# EAGLE design BD0005 (EAGLE 9.5.2)
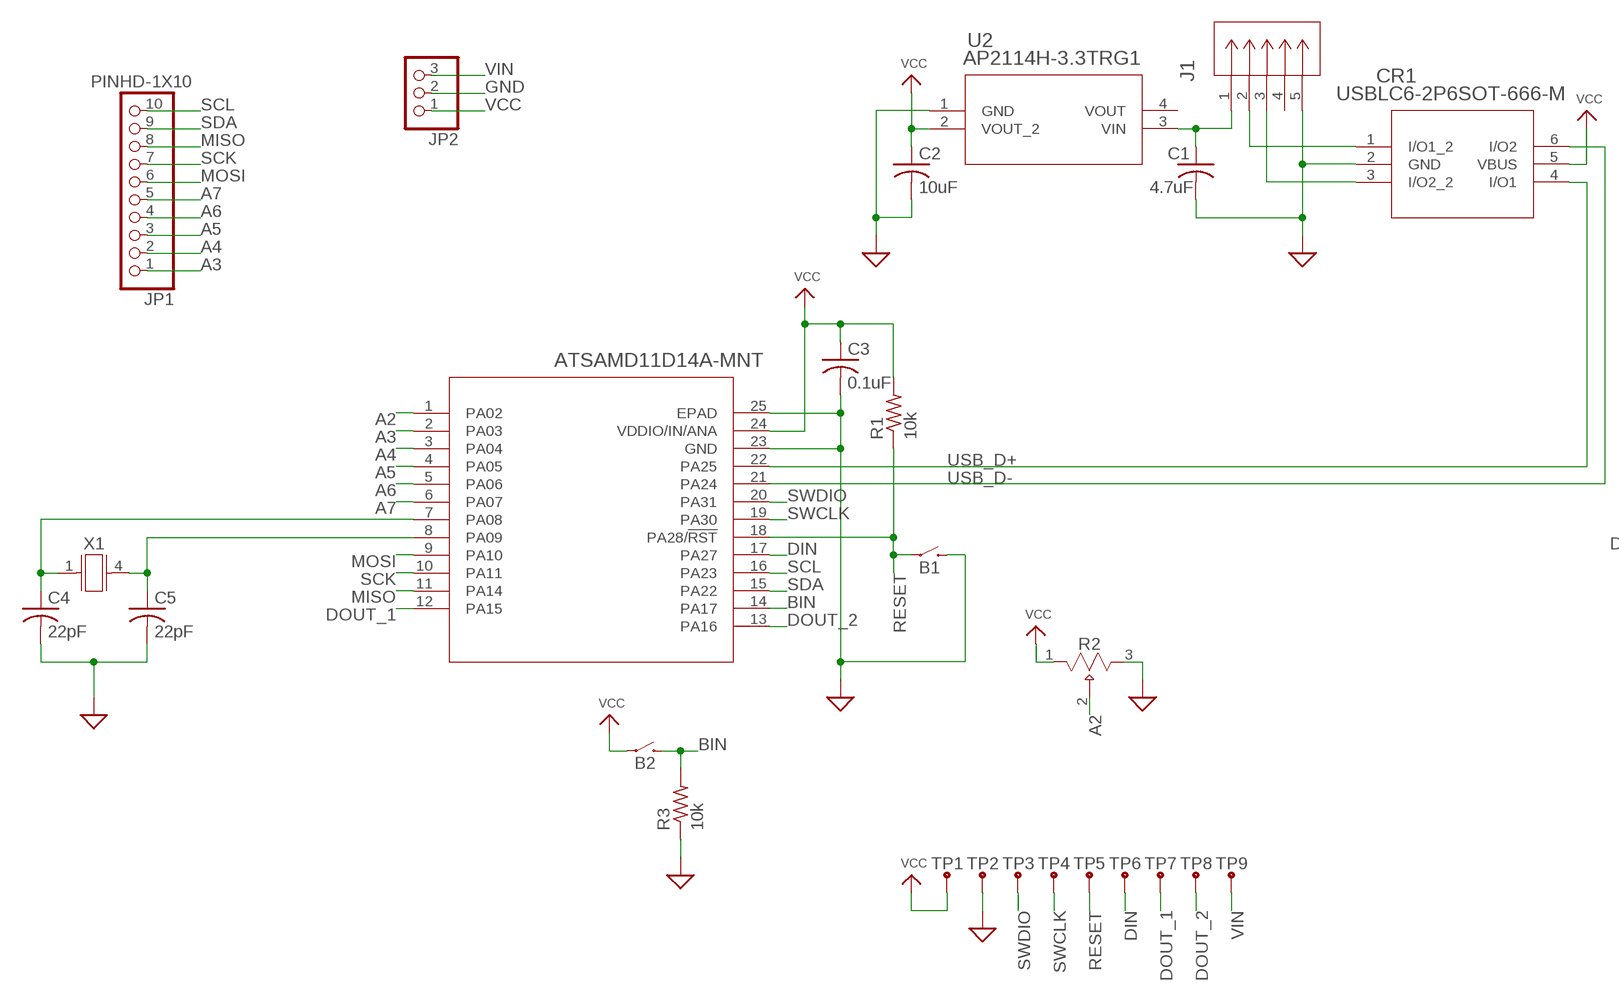
[diagram p0: schematic, sheet 1, part 1 of 2]
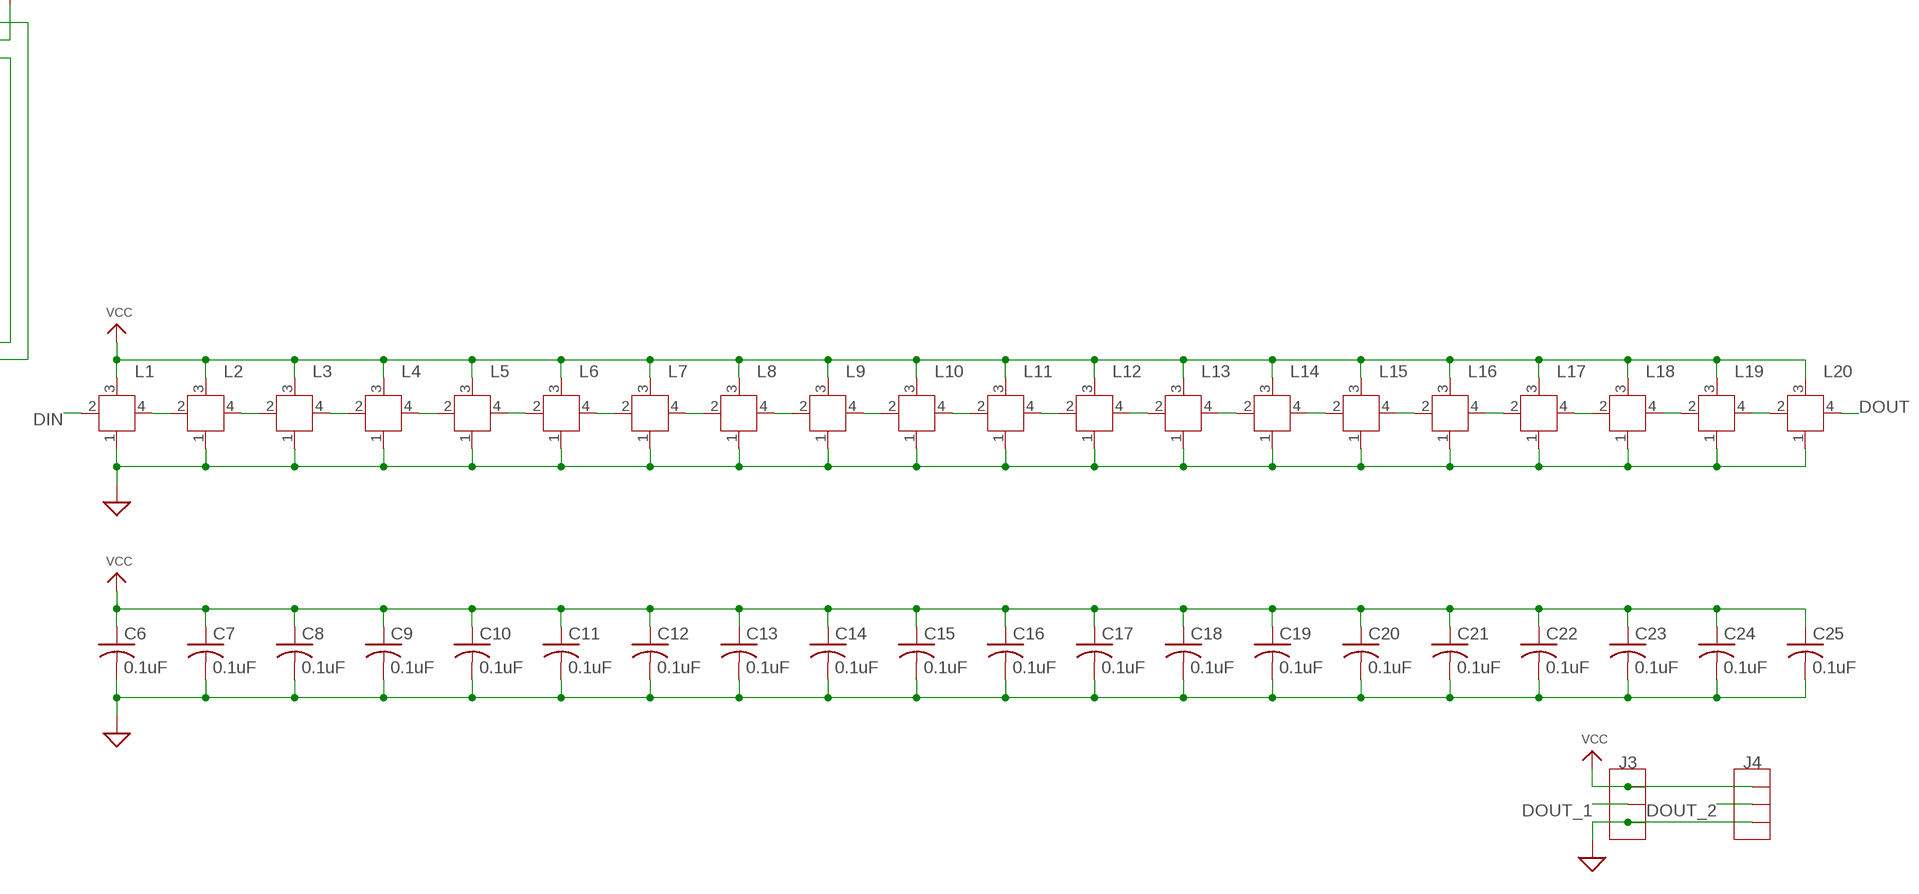
[diagram p1: schematic, sheet 1, part 2 of 2]

## Parts
B1  EVQ-P7A01P  [4-SMD_BUTTON]
B2  EVQ-P7A01P  [4-SMD_BUTTON]
C1  4.7uF  C-USC0805  [C0805]
C2  10uF  C-USC0805  [C0805]
C3  0.1uF  C-USC0402  [C0402]
C4  22pF  C-USC0402  [C0402]
C5  22pF  C-USC0402  [C0402]
C6  0.1uF  C-USC0402  [C0402]
C7  0.1uF  C-USC0402  [C0402]
C8  0.1uF  C-USC0402  [C0402]
C9  0.1uF  C-USC0402  [C0402]
C10  0.1uF  C-USC0402  [C0402]
C11  0.1uF  C-USC0402  [C0402]
C12  0.1uF  C-USC0402  [C0402]
C13  0.1uF  C-USC0402  [C0402]
C14  0.1uF  C-USC0402  [C0402]
C15  0.1uF  C-USC0402  [C0402]
C16  0.1uF  C-USC0402  [C0402]
C17  0.1uF  C-USC0402  [C0402]
C18  0.1uF  C-USC0402  [C0402]
C19  0.1uF  C-USC0402  [C0402]
C20  0.1uF  C-USC0402  [C0402]
C21  0.1uF  C-USC0402  [C0402]
C22  0.1uF  C-USC0402  [C0402]
C23  0.1uF  C-USC0402  [C0402]
C24  0.1uF  C-USC0402  [C0402]
C25  0.1uF  C-USC0402  [C0402]
CR1  USBLC6-2P6SOT-666-M  [SOT-666-M]
J1  1050171001  [CON00679_5]
J3  HEADER_1X3FEMALE  [F3SMD]
J4  HEADER_1X3FEMALE  [F3SMD]
JP1  PINHD-1X10  [1X10-BIG]
JP2  PINHD-1X3  [1X03]
L1  WS2812B  [SK6812]
L2  WS2812B  [SK6812]
L3  WS2812B  [SK6812]
L4  WS2812B  [SK6812]
L5  WS2812B  [SK6812]
L6  WS2812B  [SK6812]
L7  WS2812B  [SK6812]
L8  WS2812B  [SK6812]
L9  WS2812B  [SK6812]
L10  WS2812B  [SK6812]
L11  WS2812B  [SK6812]
L12  WS2812B  [SK6812]
L13  WS2812B  [SK6812]
L14  WS2812B  [SK6812]
L15  WS2812B  [SK6812]
L16  WS2812B  [SK6812]
L17  WS2812B  [SK6812]
L18  WS2812B  [SK6812]
L19  WS2812B  [SK6812]
L20  WS2812B  [SK6812]
R1  10k  R-US_R0402  [R0402]
R2  3352T-1-104LF  [THUMBWHEEL]
R3  10k  R-US_R0402  [R0402]
TP1  VCC  TEST_POINT  [TEST_POINT]
TP2  GND  TEST_POINT  [TEST_POINT]
TP3  DIO  TEST_POINT  [TEST_POINT]
TP4  CLK  TEST_POINT  [TEST_POINT]
TP5  RST  TEST_POINT  [TEST_POINT]
TP6  DIN  TEST_POINT  [TEST_POINT]
TP7  DO1  TEST_POINT  [TEST_POINT]
TP8  DO2  TEST_POINT  [TEST_POINT]
TP9  VIN  TEST_POINT  [TEST_POINT]
U1  ATSAMD11D14A-MNT  [QFN24_4X4MC]
U2  AP2114H-3.3TRG1  [SOT-223]
X1  MC-146-32.7680JKA-A0:ROHS  [4-SMD_FLAT_LEADS]

## Nets
A2: R2.2 U1.1(PA02)
A3: JP1.1 U1.2(PA03)
A4: JP1.2 U1.3(PA04)
A5: JP1.3 U1.4(PA05)
A6: JP1.4 U1.5(PA06)
A7: JP1.5 U1.6(PA07)
BIN: B2.2A B2.2B R3.2 U1.14(PA17)
DIN: L1.2(DIN) TP6.P$1 U1.17(PA27)
DOUT: L20.4(DOUT)
DOUT_1: J3.2A J3.2B TP7.P$1 U1.12(PA15)
DOUT_2: J4.2A J4.2B TP8.P$1 U1.13(PA16)
GND: B1.2A B1.2B C1.2 C2.2 C3.2 C4.2 C5.2 C6.2 C7.2 C8.2 C9.2 C10.2 C11.2 C12.2 C13.2 C14.2 C15.2 C16.2 C17.2 C18.2 C19.2 C20.2 C21.2 C22.2 C23.2 C24.2 C25.2 CR1.2(GND) J1.5 J3.3A J3.3B J4.3A J4.3B JP2.2 L1.1(VSS) L2.1(VSS) L3.1(VSS) L4.1(VSS) L5.1(VSS) L6.1(VSS) L7.1(VSS) L8.1(VSS) L9.1(VSS) L10.1(VSS) L11.1(VSS) L12.1(VSS) L13.1(VSS) L14.1(VSS) L15.1(VSS) L16.1(VSS) L17.1(VSS) L18.1(VSS) L19.1(VSS) L20.1(VSS) R2.3 R3.1 TP2.P$1 U1.23(GND) U1.25(EPAD) U2.1(GND) ; supply symbol labelled SUP
MISO: JP1.8 U1.11(PA14)
MOSI: JP1.6 U1.9(PA10)
N$1: CR1.3(I/O2_2) J1.3
N$3: CR1.1(I/O1_2) J1.2
N$4: C4.1 U1.7(PA08) X1.1
N$5: C5.1 U1.8(PA09) X1.4
N$8: L19.4(DOUT) L20.2(DIN)
N$9: L18.4(DOUT) L19.2(DIN)
N$10: L17.4(DOUT) L18.2(DIN)
N$11: L16.4(DOUT) L17.2(DIN)
N$12: L15.4(DOUT) L16.2(DIN)
N$13: L14.4(DOUT) L15.2(DIN)
N$14: L13.4(DOUT) L14.2(DIN)
N$15: L12.4(DOUT) L13.2(DIN)
N$16: L11.4(DOUT) L12.2(DIN)
N$17: L10.4(DOUT) L11.2(DIN)
N$18: L9.4(DOUT) L10.2(DIN)
N$19: L8.4(DOUT) L9.2(DIN)
N$20: L7.4(DOUT) L8.2(DIN)
N$21: L1.4(DOUT) L2.2(DIN)
N$22: L2.4(DOUT) L3.2(DIN)
N$23: L3.4(DOUT) L4.2(DIN)
N$24: L4.4(DOUT) L5.2(DIN)
N$25: L5.4(DOUT) L6.2(DIN)
N$26: L6.4(DOUT) L7.2(DIN)
RESET: B1.1A B1.1B R1.1 TP5.P$1 U1.18(PA28/!RST)
SCK: JP1.7 U1.10(PA11)
SCL: JP1.10 U1.16(PA23)
SDA: JP1.9 U1.15(PA22)
SWCLK: TP4.P$1 U1.19(PA30)
SWDIO: TP3.P$1 U1.20(PA31)
USB_D+: CR1.4(I/O1) U1.22(PA25)
USB_D-: CR1.6(I/O2) U1.21(PA24)
VCC: B2.1A B2.1B C2.1 C3.1 C6.1 C7.1 C8.1 C9.1 C10.1 C11.1 C12.1 C13.1 C14.1 C15.1 C16.1 C17.1 C18.1 C19.1 C20.1 C21.1 C22.1 C23.1 C24.1 C25.1 CR1.5(VBUS) J3.1A J3.1B J4.1A J4.1B JP2.1 L1.3(VDD) L2.3(VDD) L3.3(VDD) L4.3(VDD) L5.3(VDD) L6.3(VDD) L7.3(VDD) L8.3(VDD) L9.3(VDD) L10.3(VDD) L11.3(VDD) L12.3(VDD) L13.3(VDD) L14.3(VDD) L15.3(VDD) L16.3(VDD) L17.3(VDD) L18.3(VDD) L19.3(VDD) L20.3(VDD) R1.2 R2.1 TP1.P$1 U1.24(VDDIO/IN/ANA) U2.2(VOUT_2)
VIN: C1.1 J1.1 JP2.3 TP9.P$1 U2.3(VIN)
Unconnected: J1.4 U2.4(VOUT)

## Library data of the parts
B1 B2 = Clock:EVQ-P7A01P
C1-C25 = adafruit:C-US: CAPACITOR, American symbol
CR1 = Clock:USBLC6-2P6; BUILT_BY: EMA_UL_Team; MANUFACTURER_PART_NUMBER: USBLC6-2P6; VENDOR: STMicroelectronics
J1 = Clock:1050171001; BUILT_BY: EMA_Don; COPYRIGHT: Copyright (C) 2016 Accelerated Designs. All rights reserved; MANUFACTURER_PART_NUMBER: 1050171001; VENDOR: Molex Connector Corporation
J3 J4 = Clock:HEADER_1X3
JP1 = adafruit:PINHD-1X10: Pin header 1x10 0.1" spacing With round pins
JP2 = adafruit:PINHD-1X3: PIN HEADER
L1-L20 = Clock:WS2812B
R1 R3 = adafruit:R-US_: RESISTOR, American symbol
R2 = Clock:3352T-1-104LF
TP1-TP9 = Clock:TEST_POINT
U1 = Clock:ATSAMD11D14A-MNT; BUILT_BY: EMA_Molly; COPYRIGHT: Copyright (C) 2018 Accelerated Designs. All rights reserved; MANUFACTURER_PART_NUMBER: ATSAMD11D14A-MNT; VENDOR: Microchip
U2 = Clock:AP2114H-3.3TRG1; BUILT_BY: EMA_UL_Team; MANUFACTURER_PART_NUMBER: AP2114H-3.3TRG1; VENDOR: Diodes Inc
X1 = Clock:MC-146-32.7680JKA-A0:ROHS

## Board
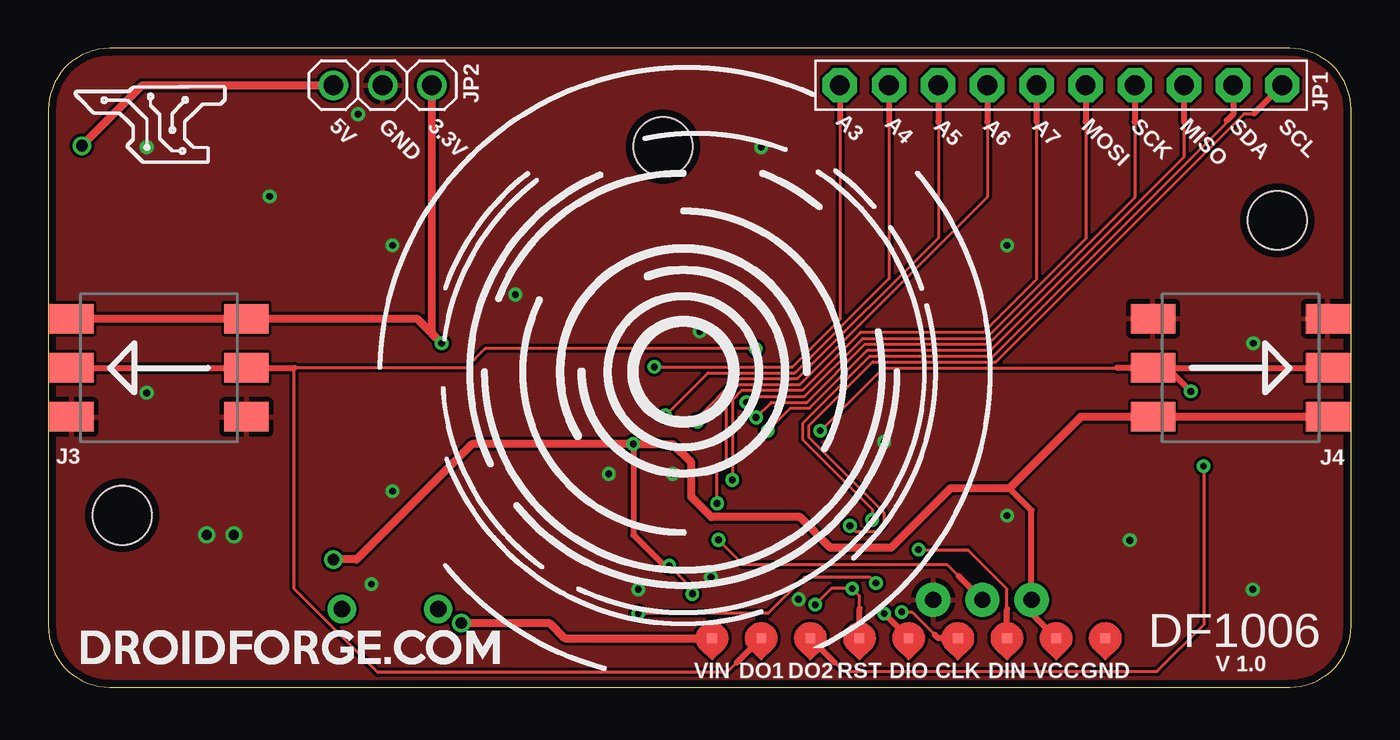
[diagram p2: board, top side]
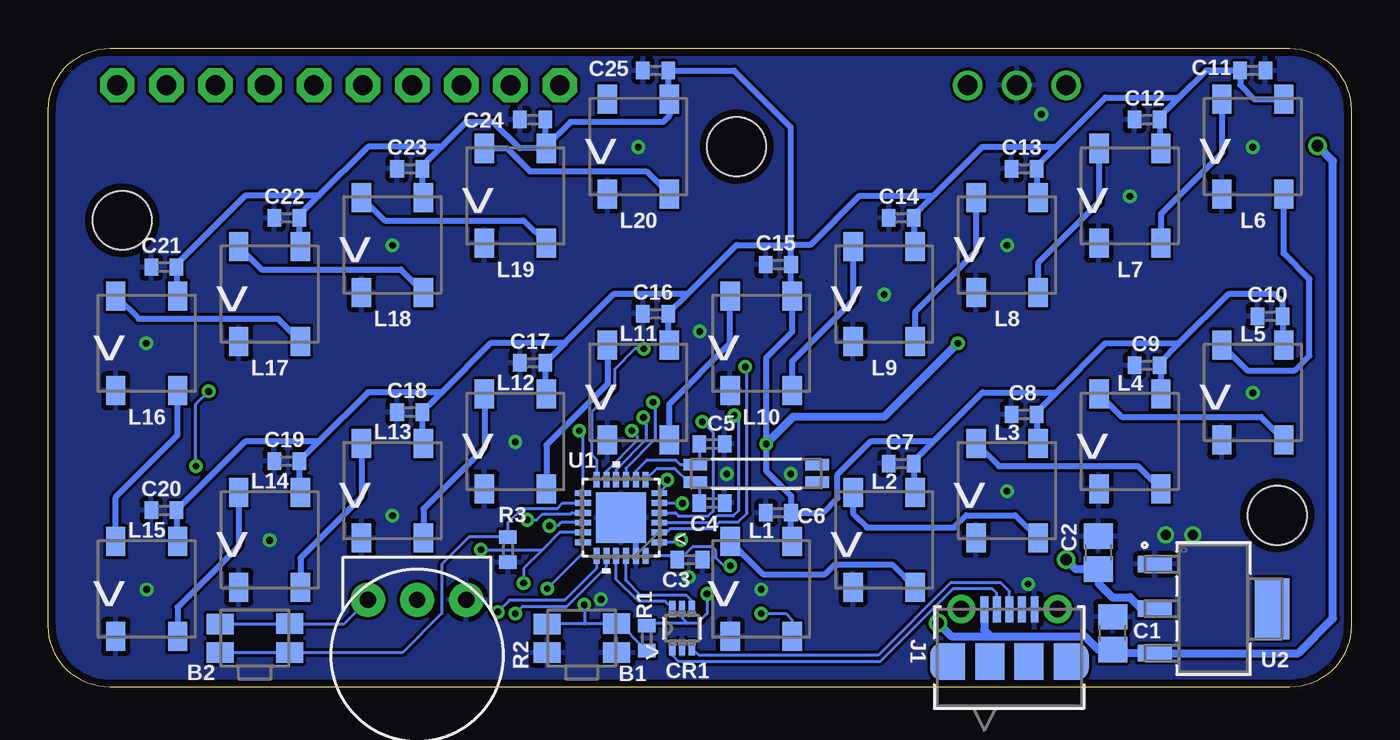
[diagram p3: board, bottom side, seen from below]

Size 67.31 x 33.02 mm. Coordinates in mm from the lower left corner, seen from the top.
Outline: 0,29.84 0,3.17 arc90 3.17,0 64.14,0 arc90 67.31,3.17 67.31,29.84 arc90 64.14,33.02 3.17,33.02 arc90 0,29.84
Copper layers (1*16): Top 0.035mm / dielectric 1.5mm / Bottom 0.035mm
Design rules "default *": minimum track width 6mil, minimum drill 0.35mm, track to track 6mil, track to pad 6mil, pad to pad 6mil, via to via 6mil, smd to smd 6mil, copper to edge 15mil, drill to drill 6mil, minimum pad ring 10mil, minimum via ring 7mil, stop-mask expansion 3mil, vias tented up to drill 25mil, thermal gap 10mil
Holes 3.05 mm at 31.75,27.94 3.81,8.89 63.5,24.13

### Footprints (pad centres in the part's own frame; a part is rotated, then mirrored left to right if it is on the bottom)
4-SMD_BUTTON = smd 1.4 x 1.05: 1A -1.8,0.725; 1B 1.8,0.75; 2A -1.8,-0.75; 2B 1.8,-0.75
C0805 = smd 1.3 x 1.5: 1 -0.85,0; 2 0.85,0
C0402 = smd 0.7 x 0.9: 1 -0.65,0; 2 0.65,0
SOT-666-M = smd 0.762 x 0.33: 1 -1.029,0.5; 2 -1.029,0; 3 -1.029,-0.5; 4 1.029,-0.5; 5 1.029,0; 6 1.029,0.5
CON00679_5 = smd 0.406 x 1.346: 1 -1.302,2.504; 2 -0.652,2.504; 3 -0.002,2.504; 4 0.648,2.504; 5 1.298,2.504 | drill 0.864 pad 1.448: 6 -2.489,2.515; 7 2.489,2.515 | smd 1.499 x 1.905: 8 -1.002,-0.196; 9 0.998,-0.196 | smd 1.194 x 1.905: 10 -3.502,-0.196; 11 3.498,-0.196 | smd 1.201 x 1.905: 12 -2.902,-0.196; 13 2.898,-0.196
F3SMD = smd 1.524 x 2.286: 1A -2.54,4.521; 1B -2.54,-4.521; 2A 0,4.521; 2B 0,-4.521; 3A 2.54,4.521; 3B 2.54,-4.521
1X10-BIG = drill 1.016 pad 1.778 octagon: 1 -11.43,0; 2 -8.89,0; 3 -6.35,0; 4 -3.81,0; 5 -1.27,0; 6 1.27,0; 7 3.81,0; 8 6.35,0; 9 8.89,0; 10 11.43,0
1X03 = drill 1.016: 1 -2.54,0; 2 0,0; 3 2.54,0
SK6812 = smd 1.5 x 1: 1 -2.45,1.6; 2 -2.45,-1.6; 3 2.45,-1.6; 4 2.45,1.6
R0402 = smd 0.7 x 0.9: 1 -0.65,0; 2 0.65,0
THUMBWHEEL = drill 0.85 pad 1.778: 1 -2.54,2.865; 2 0,2.865; 3 2.54,2.865
TEST_POINT = smd 0.508 x 0.508: P$1 0,0
QFN24_4X4MC = smd 0.813 x 0.305: 1 -1.968,1.27; 2 -1.968,0.762; 3 -1.968,0.254; 4 -1.968,-0.254; 5 -1.968,-0.762; 6 -1.968,-1.27; 13 1.968,-1.27; 14 1.968,-0.762; 15 1.968,-0.254; 16 1.968,0.254; 17 1.968,0.762; 18 1.968,1.27 | smd 0.305 x 0.813: 7 -1.27,-1.968; 8 -0.762,-1.968; 9 -0.254,-1.968; 10 0.254,-1.968; 11 0.762,-1.968; 12 1.27,-1.968; 19 1.27,1.968; 20 0.762,1.968; 21 0.254,1.968; 22 -0.254,1.968; 23 -0.762,1.968; 24 -1.27,1.968 | smd 2.591 x 2.591: 25 0,0
SOT-223 = smd 0.851 x 1.761: 1 -2.3,-3.025; 2 0,-3.025; 3 2.3,-3.025 | smd 3.151 x 1.761: 4 0,3.025
4-SMD_FLAT_LEADS = smd 1.2 x 0.6: 1 -3.15,-0.45; 2 3.15,-0.45; 3 3.15,0.45; 4 -3.15,0.45

### Placement (x,y rotation side)
B1  39.75,2.54 0 bottom
B2  56.64,2.54 0 bottom
C1  12.32,2.79 90 bottom
C2  13.06,6.96 90 bottom
C3  34.16,6.6 0 bottom
C4  33.02,9.53 0 bottom
C5  33.02,12.57 0 bottom
C6  29.59,9.02 180 bottom
C7  23.24,11.56 180 bottom
C8  16.89,14.1 180 bottom
C9  10.54,16.64 180 bottom
C10  4.19,19.18 180 bottom
C11  5.08,31.88 0 bottom
C12  10.54,29.34 180 bottom
C13  16.89,26.8 180 bottom
C14  23.24,24.26 180 bottom
C15  29.59,21.84 180 bottom
C16  35.94,19.3 180 bottom
C17  42.29,16.76 180 bottom
C18  48.64,14.22 180 bottom
C19  54.99,11.68 180 bottom
C20  61.34,9.14 180 bottom
C21  61.34,21.72 180 bottom
C22  54.99,24.26 180 bottom
C23  48.64,26.8 180 bottom
C24  42.29,29.34 180 bottom
C25  35.94,31.88 180 bottom
CR1  34.57,3.05 90 bottom
J1  17.65,1.52 0 bottom
J3  5.71,16.51 270 top
J4  61.59,16.51 90 top
JP1  52.32,31.11 0 top
JP2  17.27,31.11 180 top
L1  30.48,5.08 90 bottom
L2  24.13,7.62 90 bottom
L3  17.78,10.16 90 bottom
L4  11.43,12.7 90 bottom
L5  5.08,15.24 90 bottom
L6  5.08,27.94 90 bottom
L7  11.43,25.4 90 bottom
L8  17.78,22.86 90 bottom
L9  24.13,20.32 90 bottom
L10  30.48,17.78 90 bottom
L11  36.83,15.24 90 bottom
L12  43.18,12.7 90 bottom
L13  49.53,10.16 90 bottom
L14  55.88,7.62 90 bottom
L15  62.23,5.08 90 bottom
L16  62.23,17.78 90 bottom
L17  55.88,20.32 90 bottom
L18  49.53,22.86 90 bottom
L19  43.18,25.4 90 bottom
L20  36.83,27.94 90 bottom
R1  36.4,2.54 90 bottom
R2  48.26,1.65 0 bottom
R3  43.56,7.11 90 bottom
TP1  52.07,2.54 0 top
TP2  54.61,2.54 0 top
TP3  44.45,2.54 0 top
TP4  46.99,2.54 0 top
TP5  41.91,2.54 0 top
TP6  49.53,2.54 0 top
TP7  36.83,2.54 0 top
TP8  39.37,2.54 0 top
TP9  34.29,2.54 0 top
U1  37.72,8.76 180 bottom
U2  7.11,4.06 270 bottom
X1  30.73,11.05 0 bottom

### Tracks (layer width: path | path; a pad name or v marks a point on that pad's centre or on a via)
A2  (via drill 0.35)
  Top 0.152: 47.03,5.75 46.43,6.35 35.88,6.35 v34.62,7.61
  Top 0.305: R2.2 47.03,5.75
  Bottom 0.152: U1.1 34.74,7.49 v34.62,7.61
A3  (via drill 0.35)
  Top 0.152: 40.89,29.21 40.89,19.01 38.44,16.56 v31.31,16.56
  Top 0.305: JP1.1 40.89,29.21
  Bottom 0.152: v31.31,16.56 31.21,16.46 31.21,9 31.67,8.54 32.64,8.54 32.98,8.2 35.17,8.2 35.38,8 U1.2
A4  (via drill 0.35)
  Top 0.152: 43.43,29.21 43.43,21.12 38.57,16.25 34.08,16.25 v31.88,14.05
  Top 0.305: JP1.2 43.43,29.21
  Bottom 0.152: U1.3 33.1,8.51 32.77,8.85 31.93,8.85 31.65,9.12 31.65,13.82 v31.88,14.05
A5  (via drill 0.35)
  Top 0.152: 45.97,29.21 45.97,23.23 38.7,15.95 35.56,15.95 33.53,13.91 v33.53,13.72
  Top 0.305: JP1.3 45.97,29.21
  Bottom 0.152: U1.4 34.92,9.02 34.75,8.85 33.23,8.85 32.95,9.12 32.95,13.14 v33.53,13.72
A6  (via drill 0.35)
  Top 0.152: v34.55,9.5 34.55,11.18 35.03,11.66 35.03,14.98 35.69,15.64 38.82,15.64 48.51,25.33 48.51,29.21
  Top 0.305: JP1.4 48.51,29.21
  Bottom 0.152: U1.5 34.58,9.53 v34.55,9.5
A7  (via drill 0.35)
  Top 0.152: 51.05,29.21 51.05,21.08 48.31,18.34 41.95,18.34 38.95,15.34 35.82,15.34 35.34,14.86 v35.34,10.71
  Top 0.305: JP1.5 51.05,29.21
  Bottom 0.152: U1.6 35.34,10.45 v35.34,10.71
BIN
  Bottom 0.152: B2.2A B2.2B 49.01,1.79 46.99,3.81 46.99,6.35 45.58,7.76 R3.2 43.56,8.51 42.82,9.25 41,9.25 40.73,9.53 U1.14
DIN  (via drill 0.35)
  Top 0.152: 49.53,4.04 49.53,5.08 47.5,7.11 v44.96,7.11 | v30.48,3.81 37.18,3.81 39.06,5.68 42.46,5.68 v42.76,5.39
  Top 0.305: TP6.P$1 49.53,4.04
  Bottom 0.152: U1.17 40.89,8 41.78,7.11 | v44.96,7.11 41.78,7.11 | v30.48,3.81 29.21,3.81 28.88,3.48 L1.2 | 41.78,7.11 42.76,6.14 v42.76,5.39
DOUT_1  (via drill 0.35)
  Top 0.152: v36.55,17.5 22.57,17.5 21.59,16.51 12.7,16.51 12.7,5.08 17.02,0.76 35.05,0.76 35.56,1.27
  Top 0.305: J3.2B J3.2A 12.7,16.51 | TP7.P$1 35.56,1.27
  Bottom 0.152: U1.12 38.99,11.78 39.24,12.03 39.24,14.22 38.05,15.42 38.05,16.43 36.99,17.5 v36.55,17.5
DOUT_2  (via drill 0.35)
  Top 0.152: v39.88,13.26 43.13,16.51 55.22,16.51 57.15,16.51 57.81,16.51 66.04,16.51 J4.2B | 40.64,1.27 41.1,0.81 57.28,0.81 59.69,3.23 v59.69,11.43
  Top 0.305: J4.2A 57.15,16.51 | J4.2A 55.22,16.51 | J4.2A 66.04,16.51 | J4.2A 57.81,16.51 v59.03,15.29 | TP8.P$1 40.64,1.27
  Bottom 0.152: U1.13 39.69,13.06 v39.88,13.26 | v59.69,11.43 59.69,14.63 v59.03,15.29
GND  (via drill 0.35, 0.5)
  Bottom 0.305: U1.23 36.96,8 U1.25
  other vias: 32.26,11.02 28.96,11.02 16,29.62 11.43,25.37 17.78,22.83 24.13,20.29 5.08,27.91 5.08,15.21 17.78,10.13 30.48,5.05 55.88,7.59 62.23,5.05 43.18,12.67 49.53,22.83 62.26,17.78 36.83,27.91 33.66,18.39 49.53,8.86 34.24,5.69 16.69,5.33 38.76,4.55 9.58,7.87 8.18,7.87
  pour Top: -2.54,-2.54 69.85,-2.54 69.85,35.56 -2.54,35.56
  pour Bottom: -2.54,-2.54 69.85,-2.54 69.85,35.56 -2.54,35.56
MISO  (via drill 0.35)
  Top 0.152: 58.67,29.21 58.67,27.41 48.69,17.42 42.33,17.42 39.33,14.42 38.33,14.42 v37.16,13.26
  Top 0.305: JP1.8 58.67,29.21
  Bottom 0.152: v37.16,13.26 36.89,12.98 36.89,12.76 38.48,11.17 U1.11
MOSI  (via drill 0.35)
  Top 0.152: 53.59,29.21 53.59,23.19 48.44,18.03 42.08,18.03 39.08,15.03 36.37,15.03 v36.07,14.73
  Top 0.305: JP1.6 53.59,29.21
  Bottom 0.152: v36.07,14.73 35.96,14.62 35.96,12.83 37.47,11.32 U1.9
N$1
  Bottom 0.152: J1.3 17.66,4.96 18.09,5.38 20.7,5.38 24.43,1.65 33.7,1.65 CR1.3
N$3
  Bottom 0.152: J1.2 18.3,4.84 18.54,5.08 20.57,5.08 24.31,1.35 34.77,1.35 35.07,1.65 CR1.1
N$4
  Bottom 0.152: C4.1 33.67,10.38 X1.1 34.23,10.6 34.96,11.32 35.86,11.32 U1.7
N$5
  Bottom 0.152: U1.8 36.96,11.18 36.38,11.75 34.9,11.75 34.65,11.5 X1.4 33.67,11.71 C5.1
N$8
  Bottom 0.305: L20.2 36.41,26.67 42.43,26.67 43.61,27.85 L19.4
N$9
  Bottom 0.305: L18.4 49.95,24.13 42.76,24.13 L19.2
N$10
  Bottom 0.305: L17.4 56.3,21.59 49.11,21.59 L18.2
N$11
  Bottom 0.305: L16.4 62.65,19.05 55.46,19.05 L17.2
N$12
  Bottom 0.305: L15.4 63.83,9.83 60.63,13.03 L16.2
N$13
  Bottom 0.305: L14.4 57.48,7.29 60.63,4.14 L15.2
N$14
  Bottom 0.305: L13.4 51.13,9.83 54.28,6.68 L14.2
N$15
  Bottom 0.305: L12.4 44.78,12.37 47.93,9.22 L13.2
N$16
  Bottom 0.305: L11.4 38.43,15.67 41.58,12.52 L12.2
N$17
  Bottom 0.305: L10.4 32.08,17.78 35.23,14.63 L11.2
N$18
  Bottom 0.305: L9.4 25.73,19.99 28.88,16.84 L10.2
N$19
  Bottom 0.305: L8.4 19.38,22.53 22.53,19.38 L9.2
N$20
  Bottom 0.305: L7.4 13.03,25.07 16.18,21.92 L8.2
N$21
  Bottom 0.305: L2.2 23.71,6.35 26.67,6.35 27.18,5.84 30.39,5.84 L1.4
N$22
  Bottom 0.305: L3.2 17.36,8.89 19.88,8.89 20.52,8.26 25.02,8.26 25.73,8.97 L2.4
N$23
  Bottom 0.305: L3.4 18.2,11.43 11.01,11.43 L4.2
N$24
  Bottom 0.305: L4.4 11.85,13.97 4.66,13.97 L5.2
N$25
  Bottom 0.305: L6.2 3.48,22.43 2.16,21.11 2.16,17.14 2.92,16.38 5.37,16.38 L5.4
N$26
  Bottom 0.305: L6.4 6.68,27.61 9.83,24.46 L7.2
RESET  (via drill 0.35)
  Top 0.152: 41.91,4.06 41.91,4.72 v41.53,5.1 40.46,5.1 v39.62,4.26
  Top 0.305: TP5.P$1 41.91,4.06
  Bottom 0.152: v41.53,5.1 39.69,6.94 U1.18 | B1.1B 37.98,3.27 38.1,3.27 | 38.1,3.27 38.1,3.45 37.96,3.45 R1.1 | 38.1,3.27 39.62,3.27 | 39.62,3.27 B1.1A | v39.62,4.26 39.62,3.27
SCK  (via drill 0.35)
  Top 0.152: 56.13,29.21 56.13,25.3 48.57,17.73 42.2,17.73 39.2,14.73 37.35,14.73 v36.56,13.94
  Top 0.305: JP1.7 56.13,29.21
  Bottom 0.152: v36.56,13.94 36.42,13.8 36.42,12.8 37.97,11.24 U1.10
SCL  (via drill 0.35)
  Top 0.152: v41.41,8.34 41.71,8.04 42.82,8.04 43.17,8.39 43.17,9.03 39.27,12.92 39.27,13.51 42.58,16.82 48.95,16.82 61.78,29.65 62.29,29.65
  Top 0.305: 62.29,29.65 JP1.10
  Bottom 0.152: U1.16 40.82,8.51 40.98,8.34 v41.41,8.34
SDA  (via drill 0.35)
  Top 0.152: v42.56,8.65 42.56,9.2 38.97,12.8 38.97,13.63 42.45,17.12 48.82,17.12 60.83,29.13 60.83,29.24 60.88,29.29
  Top 0.305: JP1.9 61.21,29.62 60.88,29.29
  Bottom 0.152: U1.15 40.26,9.02 40.33,8.95 41.78,8.95 42.09,8.65 v42.56,8.65
SWCLK  (via drill 0.35)
  Top 0.152: v44.09,3.89 44.62,3.89 45.78,2.73
  Top 0.305: TP4.P$1 45.97,2.54 45.78,2.73
  Bottom 0.152: v44.09,3.89 43.48,4.5 40.64,4.5 38.99,6.15 U1.19
SWDIO  (via drill 0.35)
  Top 0.305: TP3.P$1 v43.18,3.81
  Bottom 0.152: U1.20 38.48,6.22 40.51,4.19 42.8,4.19 v43.18,3.81
USB_D+
  Bottom 0.152: U1.22 37.47,5.51 36.7,4.75 34.34,4.75 34.07,4.48 CR1.4
USB_D-
  Bottom 0.152: CR1.6 35.44,4.45 36.83,4.45 37.97,5.59 U1.21
VCC  (via drill 0.35, 0.6)
  Top 0.152: v32.08,6.28 33.27,5.08 v33.27,4.83
  Top 0.305: J4.1B J4.1A 55.88,13.97 53.34,13.97 | TP1.P$1 50.8,3.81 R2.1 50.8,9.14 49.66,10.29 | v32.08,6.28 31.82,6.28 30.23,7.87 v30.23,12.57
  Top 0.406: J3.1B J3.1A 19.05,19.05 v20.32,17.78 19.81,18.29 JP2.1 | J4.1B 55.88,13.97 | J4.1A 53.34,13.97 49.66,10.29 46.61,10.29 43.54,7.21 40.41,7.21 38.84,8.79 34.26,8.79 33.22,9.83 33.22,11.61 32.26,12.57 v30.23,12.57 21.89,12.57 15.93,6.6 v14.73,6.6
  Bottom 0.152: B2.1A 54.87,3.27 B2.1B 52.03,3.29 R2.1 | CR1.5 34.57,3.58 34.29,3.3 | 34.29,3.3 33.78,3.3 33.27,3.81 v33.27,4.83 | U1.24 35,6.79 C3.1 34.67,6.6 33.99,7.28 33.04,7.28 32.82,7.06 32.82,6.68 32.41,6.28 v32.08,6.28 | 34.29,3.3 36.29,3.3 R1.2
  Bottom 0.305: 8.89,30.48 7.49,31.88 C11.1 5.73,31.13 4.99,30.39 L6.3 | 15.24,27.94 12.7,30.48 8.89,30.48 | 21.59,25.4 19.05,27.94 15.24,27.94 | 34.29,20.32 31.75,22.86 28.96,22.86 | 40.64,17.78 38.1,20.32 34.29,20.32 | 53.34,12.7 50.8,15.24 46.99,15.24 | 21.59,12.7 19.05,15.24 15.24,15.24 | 53.34,25.4 50.8,27.94 46.99,27.94 | 21.59,25.4 25.4,25.4 27.94,22.86 28.96,22.86 | 28.96,22.86 28.94,22.84 C15.1 28.94,20.29 L10.3 28.88,18.36 30.23,17.02 v30.23,12.57 30.23,11.18 28.94,9.89 C6.1 | 28.96,22.86 28.96,28.96 31.88,31.88 C25.1 35.29,30.45 L20.3 35.23,29.54 35.56,29.21 40.34,29.21 41.64,27.91 | L9.3 22.59,22.83 C14.1 22.59,24.4 21.59,25.4 | 15.24,27.94 16.24,26.94 C13.1 16.24,25.37 L8.3 | L7.3 9.89,27.91 C12.1 9.89,29.48 8.89,30.48 | 40.64,17.78 44.45,17.78 46.99,15.24 | 53.34,12.7 57.15,12.7 60.69,9.16 C20.1 60.69,7.59 L15.3 | L12.3 41.64,15.21 C17.1 40.64,17.77 40.64,17.78 | 46.99,15.24 46.99,15.22 C18.1 47.99,12.67 L13.3 | L14.3 54.34,10.13 C19.1 54.34,11.7 53.34,12.7 | 34.29,20.32 34.29,20.3 C16.1 35.29,17.75 L11.3 | 21.59,12.7 24.84,12.7 26.54,11.01 26.54,9.78 27.3,9.02 C6.1 | 15.24,15.24 16.24,14.24 C8.1 16.24,12.67 L3.3 | 21.59,12.7 22.59,11.7 C7.1 22.59,10.13 L2.3 | L1.3 28.94,7.59 C6.1 | L4.3 9.83,16.58 C9.1 9.89,16.78 8.89,17.78 | L5.3 3.54,17.75 C10.1 3.54,19.92 3.94,20.32 6.35,20.32 8.89,17.78 | 15.24,15.24 12.7,17.78 8.89,17.78 | 53.34,25.4 57.15,25.4 60.69,21.86 C21.1 60.69,20.29 L16.3 | L17.3 54.34,22.83 C22.1 54.34,24.4 53.34,25.4 | 46.99,27.94 47.99,26.94 C23.1 47.99,25.37 L18.3 | C24.1 41.64,27.91 | 41.64,27.91 L19.3 42.96,27.85 44.32,29.21 45.72,29.21 46.99,27.94
  Bottom 0.406: v20.32,17.78 24.13,13.97 28.83,13.97 v30.23,12.57 | U2.2 10.84,4.06 11.42,4.65 12.35,4.65 13.06,5.36 C2.1 14.24,6.11 v14.73,6.6
VIN  (via drill 0.6)
  Top 0.406: v1.73,27.99 4.85,31.11 JP2.3 | v21.34,3.32 25.89,3.32 26.67,2.54 TP9.P$1
  Bottom 0.406: U2.3 2.73,1.76 0.94,3.56 0.94,27.2 v1.73,27.99 | U2.3 10.32,1.94 | J1.1 18.95,2.95 18.64,2.64 | 18.64,2.64 13.76,2.64 13.07,1.94 C1.1 12.14,1.76 U2.3 | 18.64,2.64 20.65,2.64 v21.34,3.32

### Text on the board
tPlace: 5V | GND | 3.3V | A3 | A4 | A5 | A6 | A7 | MOSI | SCK | MISO | SDA | SCL | DF1006 | V 1.0